# Altium schematic sheet POWER.SchDoc
size A; SheetNumber: 1; SheetTotal: 2
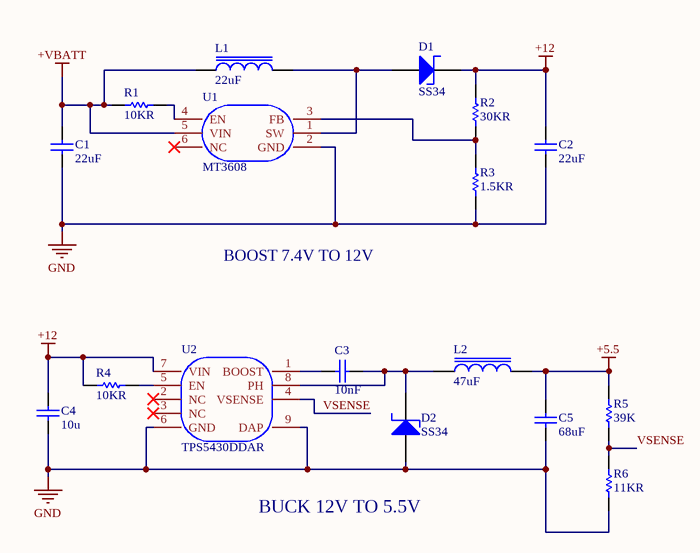
[diagram p0: POWER.SchDoc]

## Parts
C1  22uF  [CAP_0805]
C2  22uF  [CAP_0805]
C3  10nF  [CAP_0805]
C4  10u
C5  68uF  [CAP_0805]
D1  SS34  [DIO_SMA]
D2  SS34  [DIO_SMA]
L1  22uF  [IND_1280]
L2  47uF  [IND_1280]
R1  10KR  [RES_0805]
R2  30KR  [RES_0805]
R3  1.5KR  [RES_0805]
R4  10KR  [RES_0805]
R5  39K  [RES_0805]
R6  11KR  [RES_0402]
U1  MT3608  [MT3608]
U2  TPS5430DDAR  [TPS5430_8SOIC]

## Nets
+5.5: C5.2 L2.2 R5.2
+12: C2.2 C4.2 D1.2(K) R2.2 R4.2 U2.7(VIN)
+VBATT: C1.2 L1.1 R1.2 U1.5(VIN)
GND: C1.1 C2.1 C4.1 C5.1 D2.1(A) R3.1 R6.1 U1.2(GND) U2.6(GND) U2.9(DAP)
VSENSE: R5.1 R6.2 U2.4(VSENSE)
NetC3_1: C3.1 U2.1(BOOST)
NetC3_2: C3.2 D2.2(K) L2.1 U2.8(PH)
NetD1_1: D1.1(A) L1.2 U1.1(SW)
NetR1_1: R1.1 U1.4(EN)
NetR2_1: R2.1 R3.2 U1.3(FB)
NetR4_1: R4.1 U2.5(EN)

Not connected (* = marked no-connect by the designer): U1 6(NC)*; U2 2(NC)* 3(NC)*

## Notes on the sheet
- BOOST 7.4V TO 12V
- BUCK 12V TO 5.5V

## Library data of the parts
C1 C2 = CAP_22U_0805: Tụ Gốm 0805 22uF 16V
C3 = CAP_10n_0805: Tụ Gốm 0805 10nF 50V
C4 = CAP_10U_0805: Tụ Gốm 0805 10uF 25V
C5 = CAP_68u_0805: Tụ Gốm 0805 68pF 50V
D1 D2 = DIO_SS34: SS34 SMC Diode Schottky 3A
L1 = IND_22U_1280: Cuộn Cảm Dán SMD CDRH127 1280-220 22uH 6.3A
L2 = IND_47U_1280: Cuộn Cảm Dán SMD CDRH127 1280-470 47uH 3.25A
R1 R4 = RES_10K_0805: Điện Trở 10 KOhm 0805 1%
R2 = RES_30K_0805: Điện Trở 30 KOhm 0805 1%
R3 = RES_1.5K_0805: Điện Trở 1.5 KOhm 0805 1%
R5 = RES_39K_0805: Điện Trở 39 KOhm 0805 1%
R6 = RES_11K_0402: Điện Trở 11 KOhm 0402 5%
U1 = MT3608: MT3608 IC Điều Chỉnh Tăng Áp 2A SOT-23-6
U2 = TPS5430DDAR: TPS5430DDAR IC Điều Chỉnh Giảm Áp 3A 8-SOIC